# EAGLE design M700E (EAGLE 6.6.0)
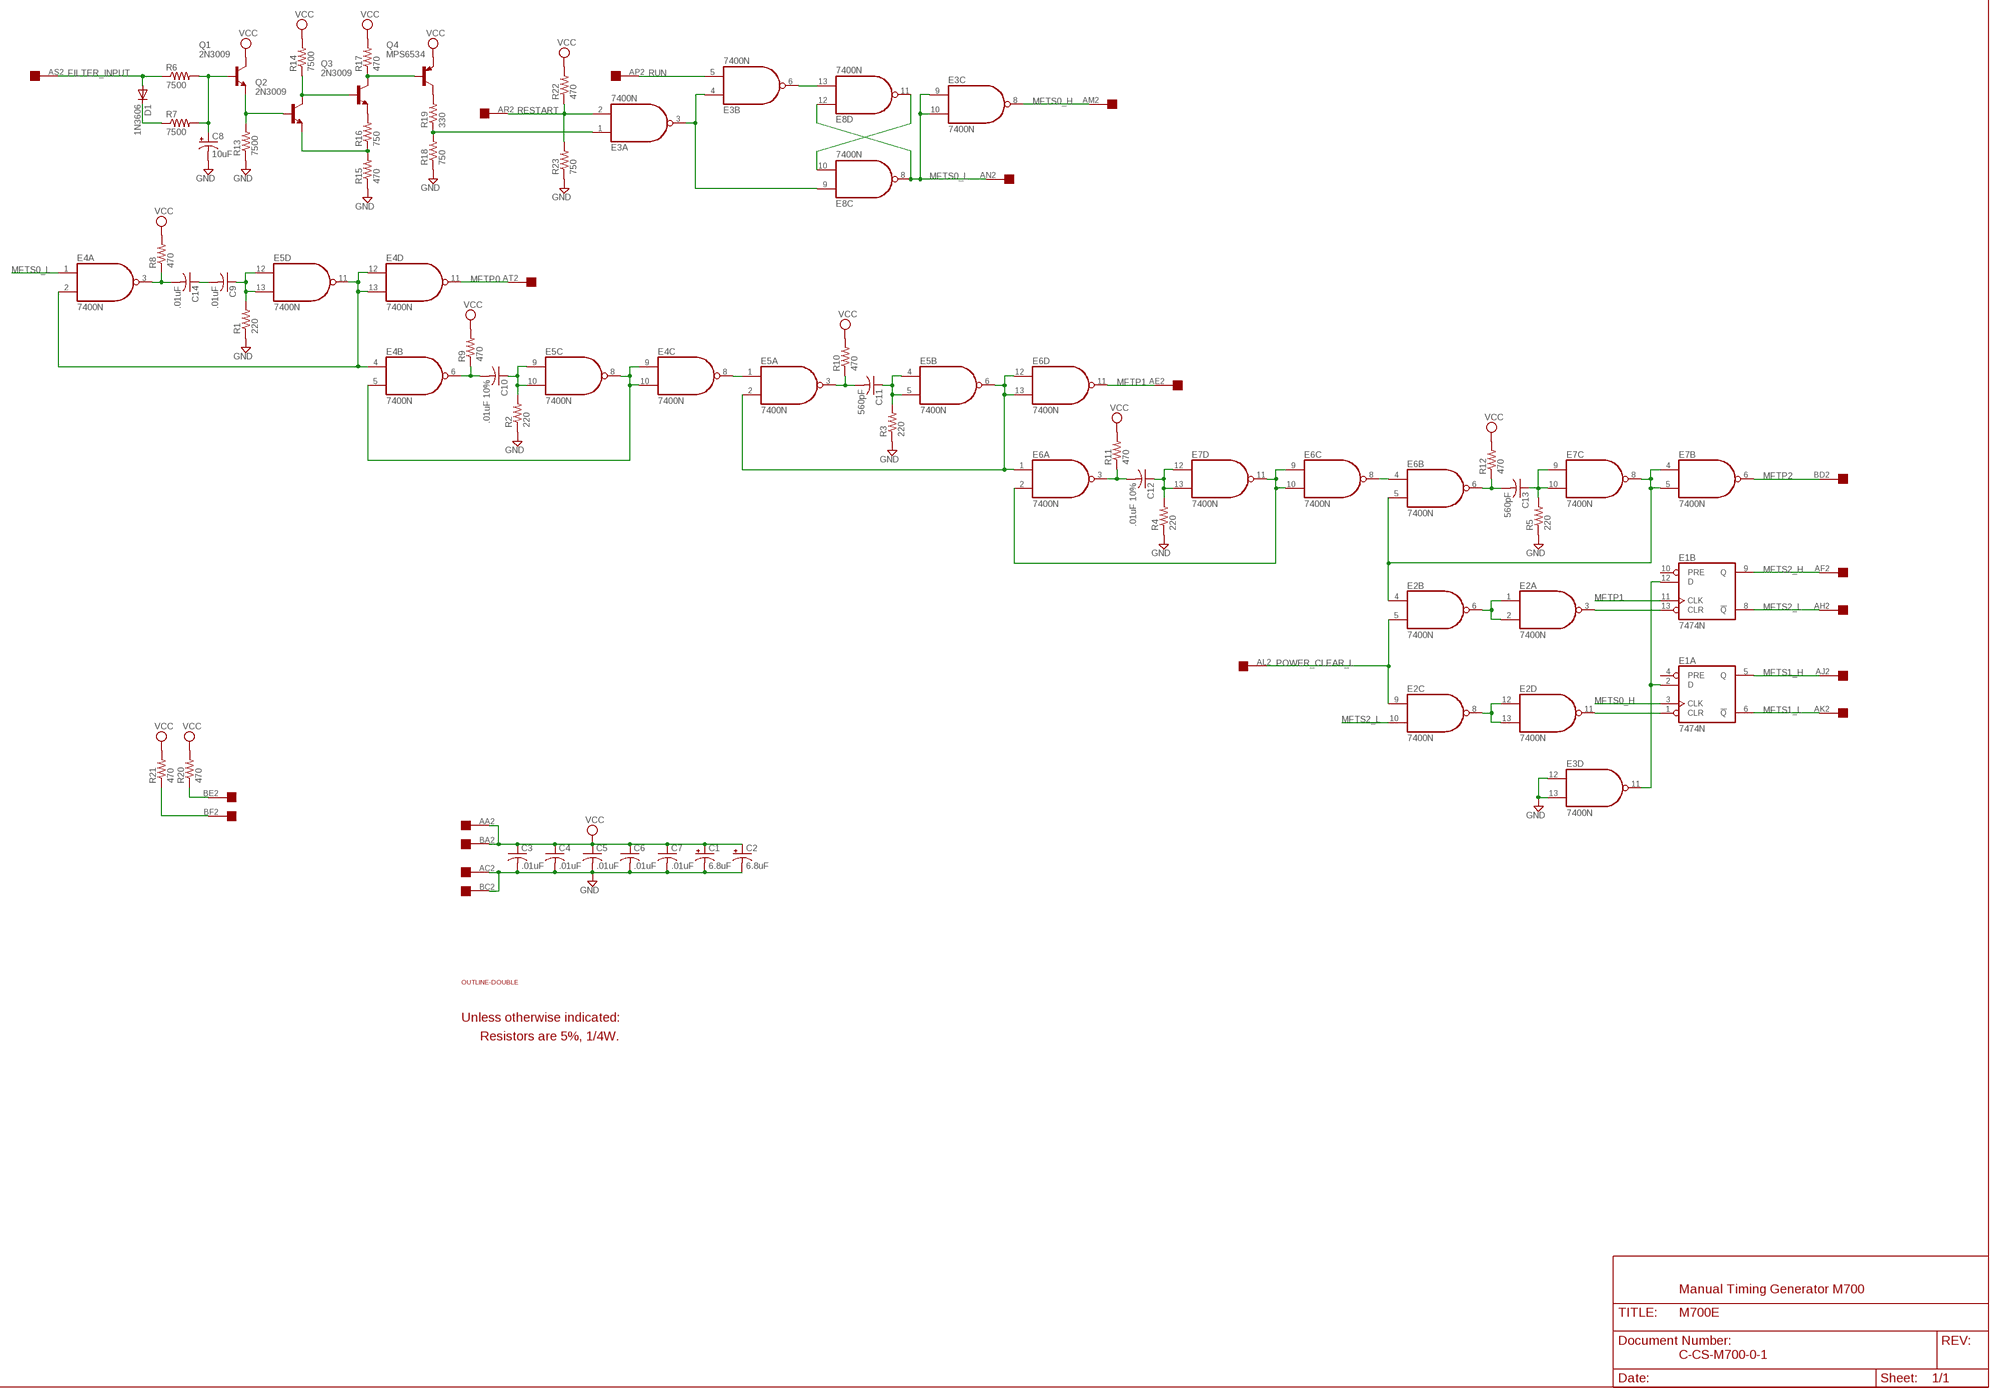
[diagram p0: schematic, sheet 1]

## Parts
C1  6.8uF  CPOL-USE20-8AXIAL  [E12-8]
C2  6.8uF  CPOL-USE20-8AXIAL  [E12-8]
C3  .01uF  C-US050-025X075  [C050-025X075]
C4  .01uF  C-US050-025X075  [C050-025X075]
C5  .01uF  C-US050-025X075  [C050-025X075]
C6  .01uF  C-US050-025X075  [C050-025X075]
C7  .01uF  C-US050-025X075  [C050-025X075]
C8  10uF  CPOL-USE20-8AXIAL  [E12-8]
C9  .01uF  C-US150-054X183  [C150-054X183]
C10  .01uF 10%  C-US150-054X183  [C150-054X183]
C11  560pF  C-US050-025X075  [C050-025X075]
C12  .01uF 10%  C-US150-054X183  [C150-054X183]
C13  560pF  C-US050-025X075  [C050-025X075]
C14  .01uF  C-US150-054X183  [C150-054X183]
D1  1N3606  1N4148DO35-10  [DO35-10]
E1  7474N  74S74N  [DIL14]
E2  7400N  [DIL14]
E3  7400N  [DIL14]
E4  7400N  [DIL14]
E5  7400N  [DIL14]
E6  7400N  [DIL14]
E7  7400N  [DIL14]
E8  7400N  [DIL14]
Q1  2N3009  2N2102  [TO5]
Q2  2N3009  2N2102  [TO5]
Q3  2N3009  2N2102  [TO5]
Q4  MPS6534  2N2905  [TO5]
R1  220  R-US_0207/10  [0207/10]
R2  220  R-US_0207/10  [0207/10]
R3  220  R-US_0207/10  [0207/10]
R4  220  R-US_0207/10  [0207/10]
R5  220  R-US_0207/10  [0207/10]
R6  7500  R-US_0207/10  [0207/10]
R7  7500  R-US_0207/10  [0207/10]
R8  470  R-US_0207/10  [0207/10]
R9  470  R-US_0207/10  [0207/10]
R10  470  R-US_0207/10  [0207/10]
R11  470  R-US_0207/10  [0207/10]
R12  470  R-US_0207/10  [0207/10]
R13  7500  R-US_0207/10  [0207/10]
R14  7500  R-US_0207/10  [0207/10]
R15  470  R-US_0207/10  [0207/10]
R16  750  R-US_0207/10  [0207/10]
R17  470  R-US_0207/10  [0207/10]
R18  750  R-US_0207/10  [0207/10]
R19  330  R-US_0207/10  [0207/10]
R20  470  R-US_0207/10  [0207/10]
R21  470  R-US_0207/10  [0207/10]
R22  470  R-US_0207/10  [0207/10]
R23  750  R-US_0207/10  [0207/10]
U$1  DOUBLE  [EDGE-CON4]
U$2  OUTLINE-DOUBLE  [DOUBLE]

## Nets
FILTER_INPUT: D1.A R6.1 U$1.AS2
GND [Supply]: C1.- C2.- C3.2 C4.2 C5.2 C6.2 C7.2 C8.- E3.12(D:I0) E3.13(D:I1) R1.1 R2.1 R3.1 R4.1 R5.1 R13.1 R15.1 R18.1 R23.1 U$1.AC2 U$1.BC2
MFTP0: E4.11(D:O) U$1.AT2
MFTP1: E1.11(B:CLK) E6.11(D:O) U$1.AE2
MFTP2: E7.6(B:O) U$1.BD2
MFTS0_H: E1.3(A:CLK) E3.8(C:O) U$1.AM2
MFTS0_L: E3.9(C:I0) E3.10(C:I1) E4.1(A:I0) E8.8(C:O) E8.12(D:I0) U$1.AN2
MFTS1_H: E1.5(A:Q) U$1.AJ2
MFTS1_L: E1.6(A:!Q) U$1.AK2
MFTS2_H: E1.9(B:Q) U$1.AF2
MFTS2_L: E1.8(B:!Q) E2.10(C:I1) U$1.AH2
N$1: E1.13(B:CLR) E2.3(A:O)
N$2: E2.4(B:I0) E6.5(B:I1) E7.4(B:I0) E7.5(B:I1) E7.8(C:O)
N$3: C13.1 E7.9(C:I0) E7.10(C:I1) R5.2
N$4: C13.2 E6.6(B:O) R12.1
N$5: E2.1(A:I0) E2.2(A:I1) E2.6(B:O)
N$6: C8.+ Q1.2(B) R6.2 R7.2
N$7: E1.2(A:D) E1.12(B:D) E3.11(D:O)
N$8: D1.C R7.1
N$9: Q2.3(C) Q3.2(B) R14.1
N$10: Q1.1(E) Q2.2(B) R13.2
N$11: R21.1 U$1.BF2
N$12: R20.1 U$1.BE2
N$13: Q3.3(C) Q4.2(B) R17.1
N$14: Q3.1(E) R16.2
N$15: Q2.1(E) R15.2 R16.1
N$16: Q4.3(C) R19.2
N$17: E3.1(A:I0) R18.2 R19.1
N$18: E3.3(A:O) E3.4(B:I0) E8.9(C:I0)
N$19: E8.10(C:I1) E8.11(D:O)
N$20: C9.1 E5.12(D:I0) E5.13(D:I1) R1.2
N$21: E3.6(B:O) E8.13(D:I1)
N$22: C14.2 E4.3(A:O) R8.1
N$23: C9.2 C14.1
N$24: E4.2(A:I1) E4.4(B:I0) E4.12(D:I0) E4.13(D:I1) E5.11(D:O)
N$25: C10.2 E4.6(B:O) R9.1
N$26: C10.1 E5.9(C:I0) E5.10(C:I1) R2.2
N$27: E4.5(B:I1) E4.9(C:I0) E4.10(C:I1) E5.8(C:O)
N$28: C11.2 E5.3(A:O) R10.1
N$29: E4.8(C:O) E5.1(A:I0)
N$30: C11.1 E5.4(B:I0) E5.5(B:I1) R3.2
N$31: E5.2(A:I1) E5.6(B:O) E6.1(A:I0) E6.12(D:I0) E6.13(D:I1)
N$32: C12.2 E6.3(A:O) R11.1
N$33: C12.1 E7.12(D:I0) E7.13(D:I1) R4.2
N$34: E6.2(A:I1) E6.9(C:I0) E6.10(C:I1) E7.11(D:O)
N$35: E2.8(C:O) E2.12(D:I0) E2.13(D:I1)
N$36: E6.4(B:I0) E6.8(C:O)
N$38: E1.1(A:CLR) E2.11(D:O)
POWER_CLEAR_L: E2.5(B:I1) E2.9(C:I0) U$1.AL2
RESTART: E3.2(A:I1) R22.1 R23.2 U$1.AR2
RUN: E3.5(B:I1) U$1.AP2
VCC [Supply]: C1.+ C2.+ C3.1 C4.1 C5.1 C6.1 C7.1 Q1.3(C) Q4.1(E) R8.2 R9.2 R10.2 R11.2 R12.2 R14.2 R17.2 R20.2 R21.2 R22.2 U$1.AA2 U$1.BA2
Unconnected: E1.4(A:PRE) E1.10(B:PRE) E7.1(A:I0) E7.2(A:I1) E7.3(A:O) E8.1(A:I0) E8.2(A:I1) E8.3(A:O) E8.4(B:I0) E8.5(B:I1) E8.6(B:O) U$1.AA1 U$1.AB1 U$1.AB2 U$1.AC1 U$1.AD1 U$1.AD2 U$1.AE1 U$1.AF1 U$1.AH1 U$1.AJ1 U$1.AK1 U$1.AL1 U$1.AM1 U$1.AN1 U$1.AP1 U$1.AR1 U$1.AS1 U$1.AT1 U$1.AU1 U$1.AU2 U$1.AV1 U$1.AV2 U$1.BA1 U$1.BB1 U$1.BB2 U$1.BC1 U$1.BD1 U$1.BE1 U$1.BF1 U$1.BH1 U$1.BH2 U$1.BJ1 U$1.BJ2 U$1.BK1 U$1.BK2 U$1.BL1 U$1.BL2 U$1.BM1 U$1.BM2 U$1.BN1 U$1.BN2 U$1.BP1 U$1.BP2 U$1.BR1 U$1.BR2 U$1.BS1 U$1.BS2 U$1.BT1 U$1.BT2 U$1.BU1 U$1.BU2 U$1.BV1 U$1.BV2

## Notes on the sheet
- Unless otherwise indicated:
- Resistors are 5%, 1/4W.
- Manual Timing Generator M700
- C-CS-M700-0-1

## Power pins joined to a net without a drawn wire
GND: E1.7(P:GND) E2.7(P:GND) E3.7(P:GND) E4.7(P:GND) E5.7(P:GND) E6.7(P:GND) E7.7(P:GND) E8.7(P:GND)
VCC: E1.14(P:VCC) E2.14(P:VCC) E3.14(P:VCC) E4.14(P:VCC) E5.14(P:VCC) E6.14(P:VCC) E7.14(P:VCC) E8.14(P:VCC)

## Library data of the parts
C1 C2 C8 = dec-con:CPOL-USE20-8AXIAL: A 0.8 inch electrolytic.
C3-C7 C9-C14 = rcl:C-US: CAPACITOR, American symbol
D1 = diode:1N4148: DIODE high speed (Philips)
E1 = 74xx-us:74*74: Dual D type positive edge triggered FLIP FLOP, preset and clear
E2-E8 = 74xx-us:74*00: Quad 2-input NAND gate
Q1-Q3 = transistor-npn:2N2102: NPN Transistor
Q4 = transistor-pnp:2N2905: PNP Transistor
R1-R23 = rcl:R-US_: RESISTOR, American symbol
U$1 = dec-con:DOUBLE: Double-Height DEC board
U$2 = dec-con:OUTLINE-*: Board outlines for DEC boards.

## Net classes
1 Supply: width 0.813 mm

## Board
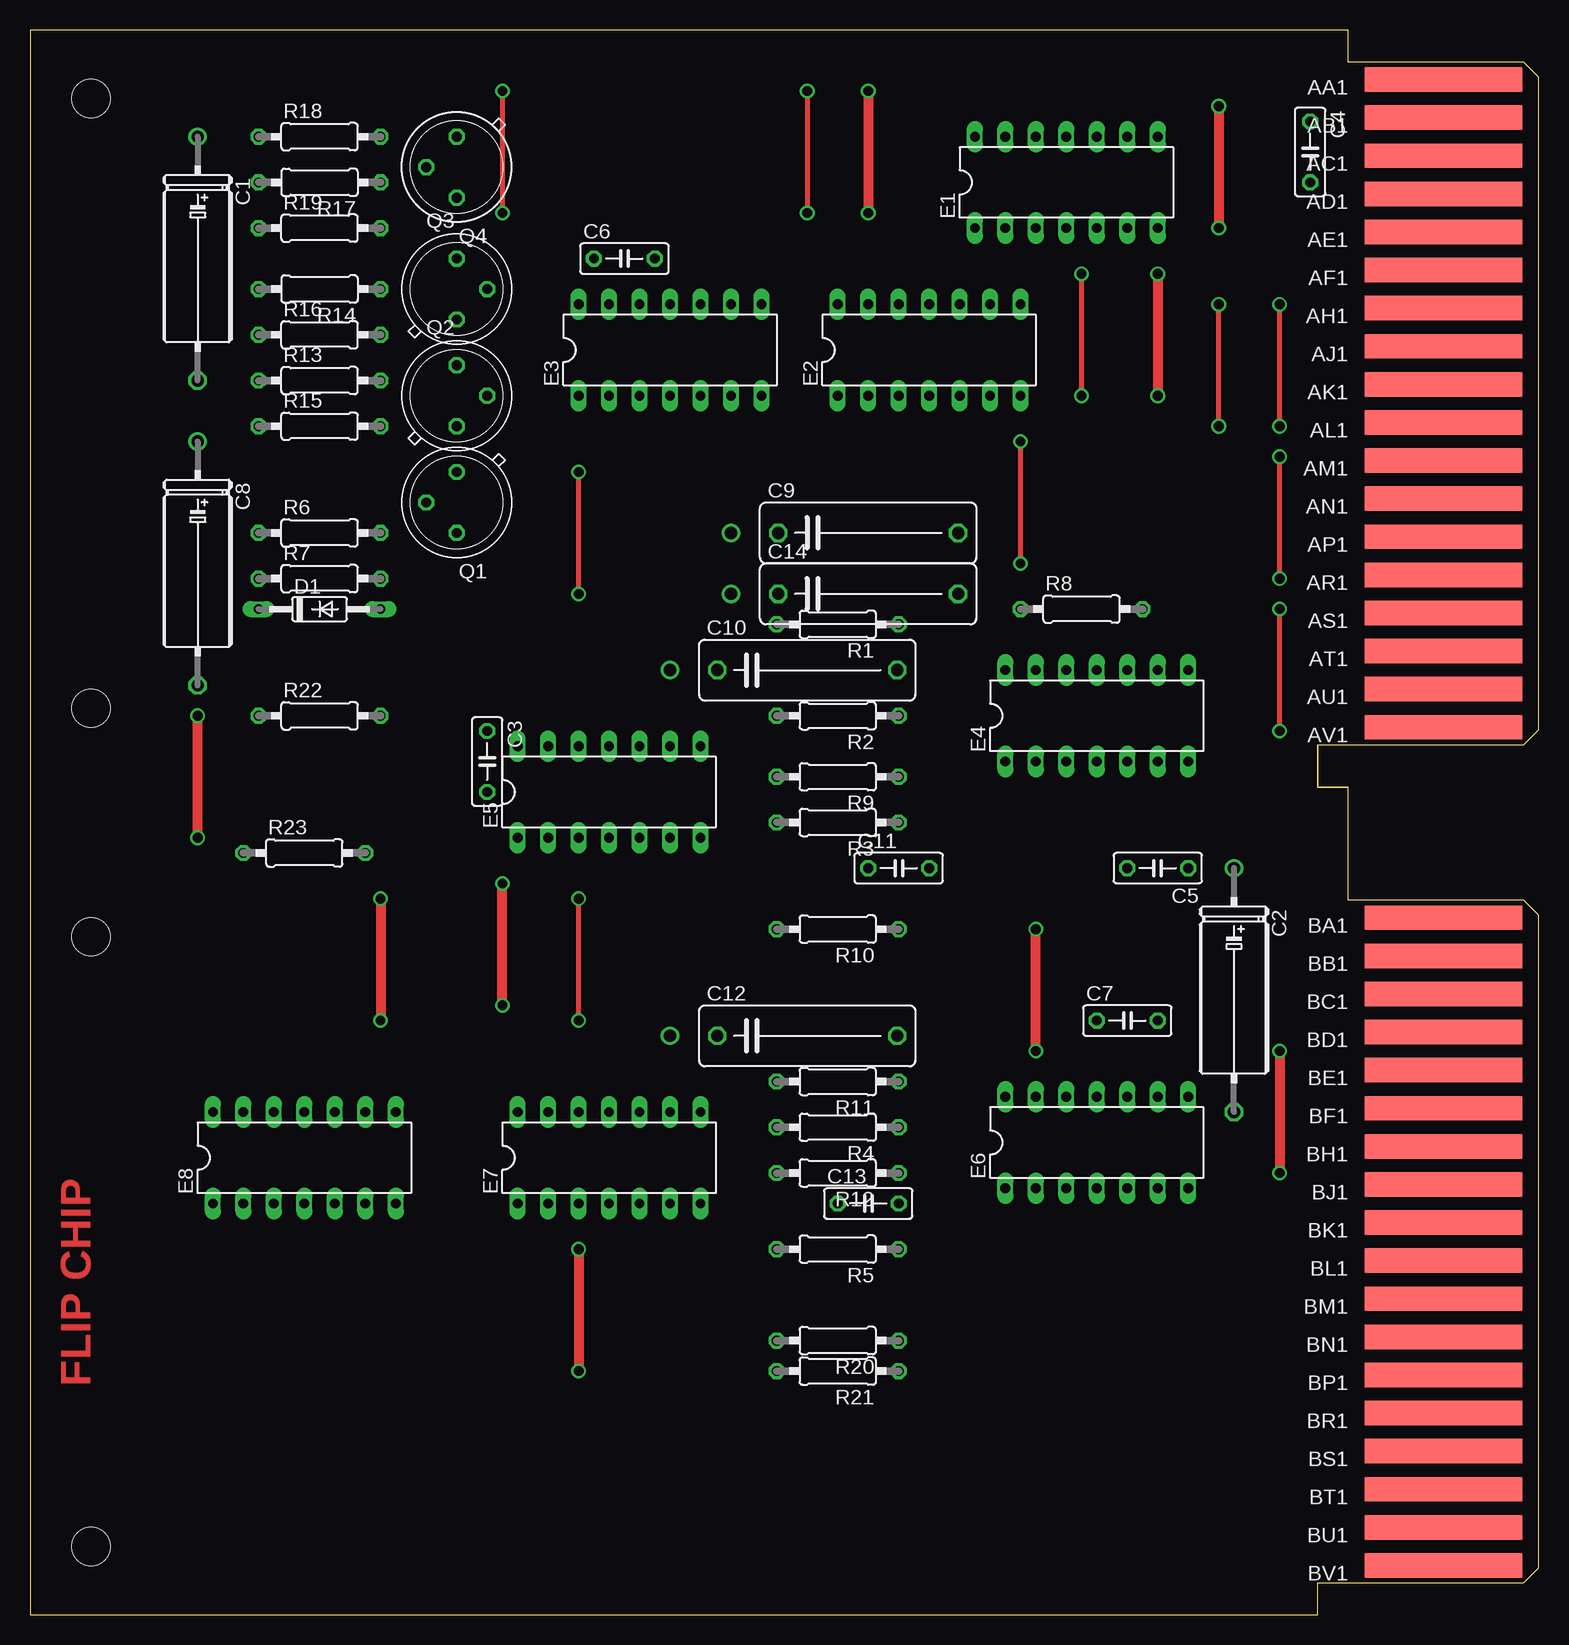
[diagram p1: board, top side]
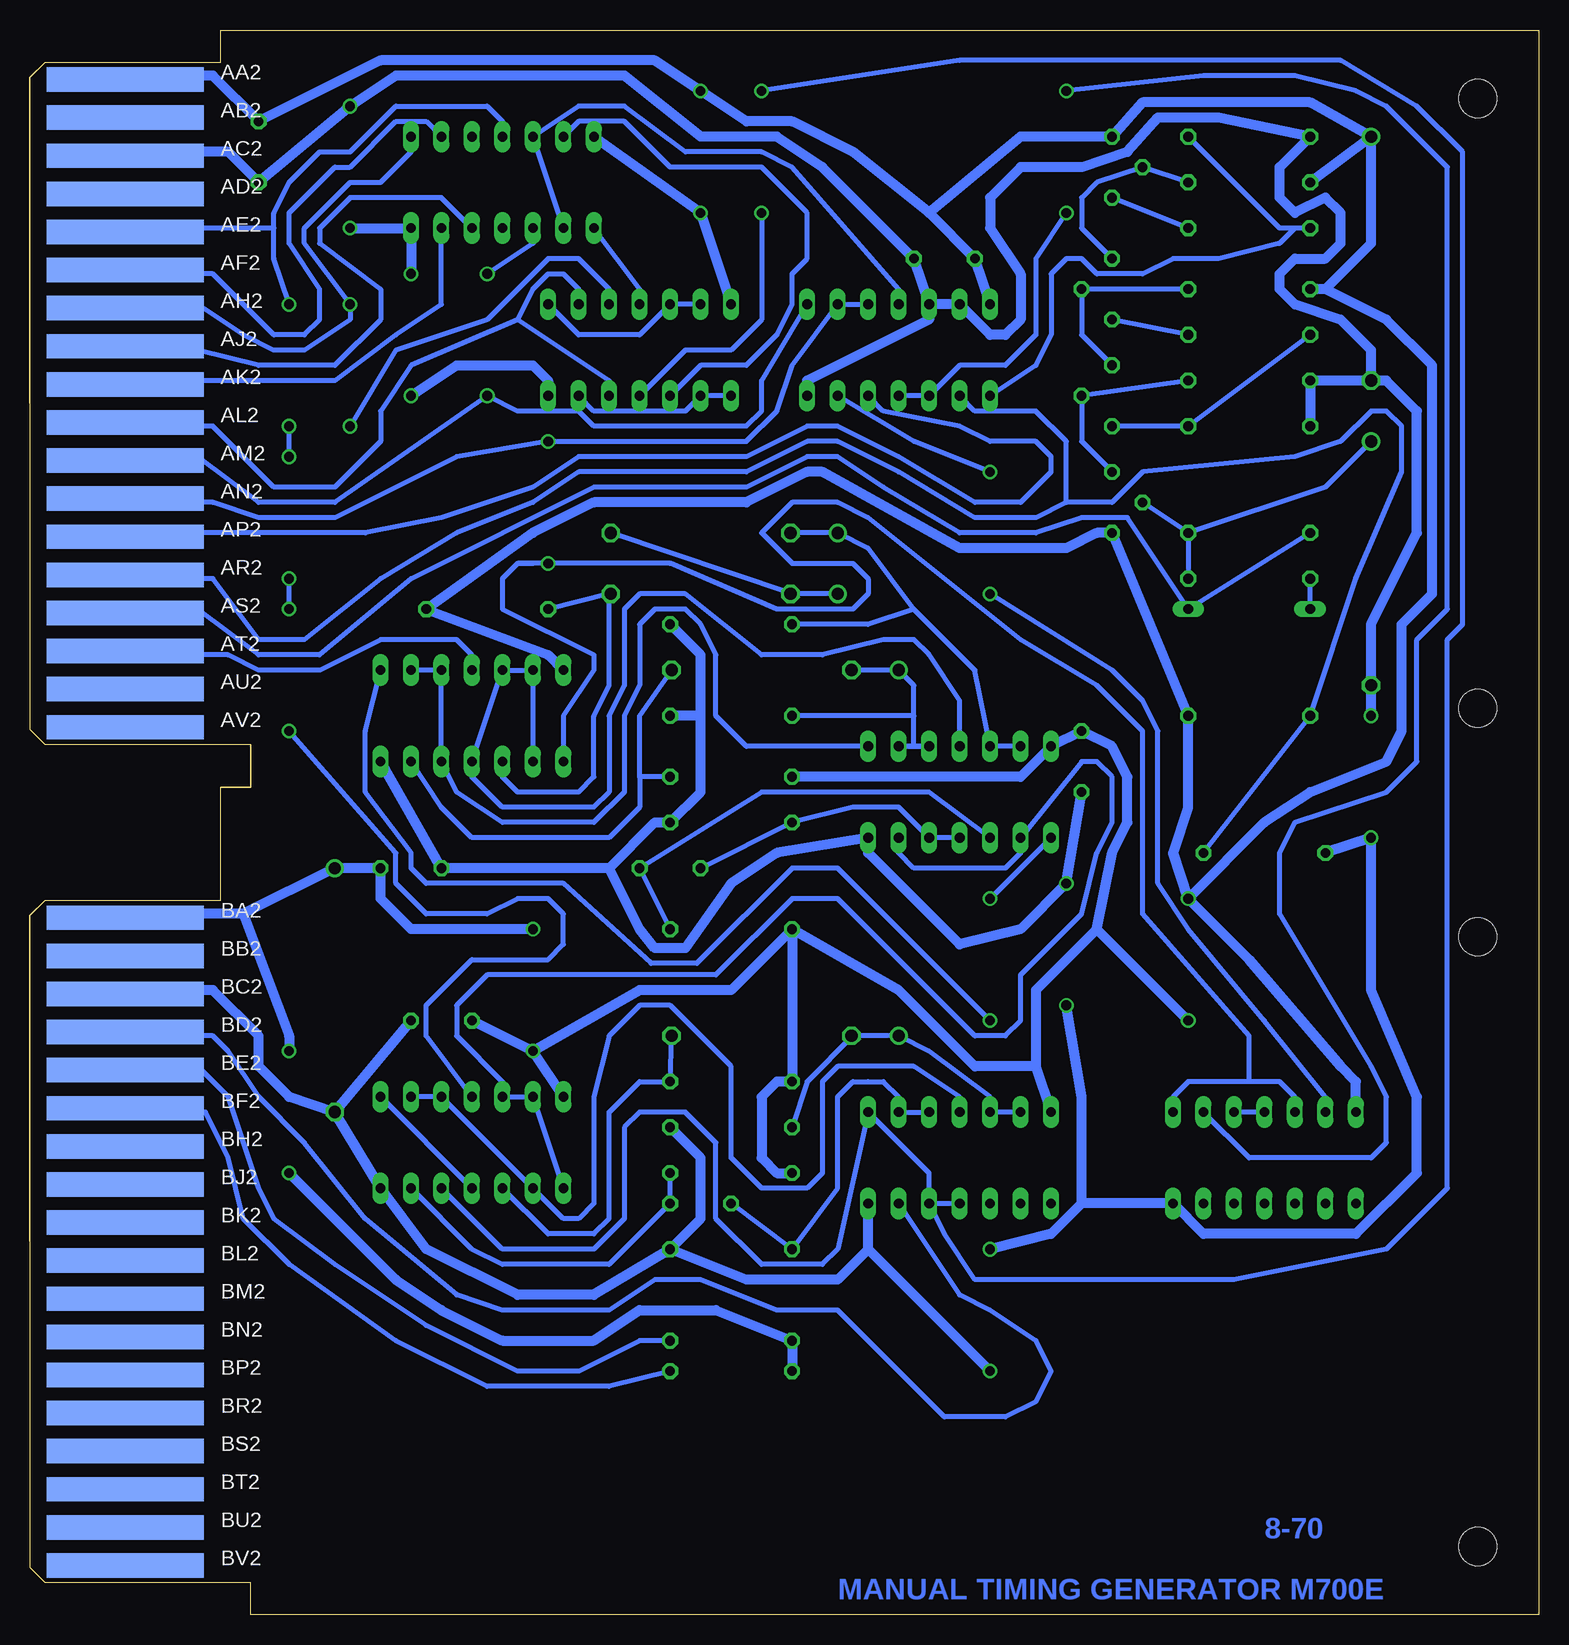
[diagram p2: board, bottom side, seen from below]

Size 125.73 x 132.08 mm. Coordinates in mm from the lower left corner, seen from the top.
Copper layers (1+16): Top 0.035mm / dielectric 1.5mm / Bottom 0.035mm
Design rules "16mils": minimum track width 16mil, minimum drill 32mil, track to track 15mil, track to pad 10mil, pad to pad 10mil, via to via 10mil, smd to smd 10mil, copper to edge 13mil, drill to drill 10mil, minimum pad ring 10mil, minimum via ring 8mil, stop-mask expansion 0mil, vias tented up to drill 0mil, thermal gap 10mil

### Footprints (pad centres in the part's own frame; a part is rotated, then mirrored left to right if it is on the bottom)
E12-8 = drill 1.016: + -10.16,0 | drill 1.016 octagon: - 10.16,0
C050-025X075 = drill 0.813 octagon: 1 -2.54,0; 2 2.54,0
C150-054X183 = drill 1.016 octagon: 1 -7.493,0; 2 7.493,0
DO35-10 = drill 0.813 long: A 5.08,0; C -5.08,0
DIL14 = drill 0.813 long: 1 -7.62,-3.81; 2 -5.08,-3.81; 3 -2.54,-3.81; 4 0,-3.81; 5 2.54,-3.81; 6 5.08,-3.81; 7 7.62,-3.81; 8 7.62,3.81; 9 5.08,3.81; 10 2.54,3.81; 11 0,3.81; 12 -2.54,3.81; 13 -5.08,3.81; 14 -7.62,3.81
TO5 = drill 0.813 octagon: 1 0,-2.54; 2 2.54,0; 3 0,2.54
0207/10 = drill 0.813 octagon: 1 -5.08,0; 2 5.08,0
EDGE-CON4 = smd 13.106 x 2.032: AA1 7.938,4.128; AB1 7.938,7.303; AC1 7.938,10.477; AD1 7.938,13.652; AE1 7.938,16.828; AF1 7.938,20.003; AH1 7.938,23.177; AJ1 7.938,26.352; AK1 7.938,29.527; AL1 7.938,32.703; AM1 7.938,35.877; AN1 7.938,39.053; AP1 7.938,42.227; AR1 7.938,45.403; AS1 7.938,48.578; AT1 7.938,51.752; AU1 7.938,54.928; AV1 7.938,58.102; BA1 7.938,73.978; BB1 7.938,77.153; BC1 7.938,80.328; BD1 7.938,83.502; BE1 7.938,86.677; BF1 7.938,89.853; BH1 7.938,93.028; BJ1 7.938,96.203; BK1 7.938,99.377; BL1 7.938,102.552; BM1 7.938,105.728; BN1 7.938,108.903; BP1 7.938,112.078; BR1 7.938,115.252; BS1 7.938,118.427; BT1 7.938,121.603; BU1 7.938,124.778; BV1 7.938,127.953 | smd 13.106 x 2.032 bottom: AA2 7.938,4.128; AB2 7.938,7.303; AC2 7.938,10.477; AD2 7.938,13.652; AE2 7.938,16.828; AF2 7.938,20.003; AH2 7.938,23.177; AJ2 7.938,26.352; AK2 7.938,29.527; AL2 7.938,32.703; AM2 7.938,35.877; AN2 7.938,39.053; AP2 7.938,42.227; AR2 7.938,45.403; AS2 7.938,48.578; AT2 7.938,51.752; AU2 7.938,54.928; AV2 7.938,58.102; BA2 7.938,73.978; BB2 7.938,77.153; BC2 7.938,80.328; BD2 7.938,83.502; BE2 7.938,86.677; BF2 7.938,89.853; BH2 7.938,93.028; BJ2 7.938,96.203; BK2 7.938,99.377; BL2 7.938,102.552; BM2 7.938,105.728; BN2 7.938,108.903; BP2 7.938,112.078; BR2 7.938,115.252; BS2 7.938,118.427; BT2 7.938,121.603; BU2 7.938,124.778; BV2 7.938,127.953
DOUBLE = hole 3.175: 120.65,56.515; 120.65,5.715; 120.65,75.565; 120.65,126.365

### Placement (x,y rotation side)
C1  13.97,113.03 270 top
C2  100.33,52.07 270 top
C3  38.1,71.12 270 top
C4  106.68,121.92 270 top
C5  93.98,62.23 180 top
C6  49.53,113.03 0 top
C7  91.44,49.53 0 top
C8  13.97,87.63 270 top
C9  69.85,90.17 0 top
C10  64.77,78.74 0 top
C11  72.39,62.23 0 top
C12  64.77,48.26 0 top
C13  69.85,34.29 0 top
C14  69.85,85.09 0 top
D1  24.13,83.82 0 top
E1  86.36,119.38 0 top
E2  74.93,105.41 0 top
E3  53.34,105.41 0 top
E4  88.9,74.93 0 top
E5  48.26,68.58 0 top
E6  88.9,39.37 0 top
E7  48.26,38.1 0 top
E8  22.86,38.1 0 top
Q1  35.56,92.71 180 top
Q2  35.56,101.6 0 top
Q3  35.56,110.49 0 top
Q4  35.56,120.65 180 top
R1  67.31,82.55 180 top
R2  67.31,74.93 180 top
R3  67.31,66.04 180 top
R4  67.31,40.64 180 top
R5  67.31,30.48 180 top
R6  24.13,90.17 0 top
R7  24.13,86.36 0 top
R8  87.63,83.82 0 top
R9  67.31,69.85 180 top
R10  67.31,57.15 180 top
R11  67.31,44.45 180 top
R12  67.31,36.83 180 top
R13  24.13,102.87 0 top
R14  24.13,110.49 180 top
R15  24.13,99.06 0 top
R16  24.13,106.68 0 top
R17  24.13,119.38 180 top
R18  24.13,123.19 0 top
R19  24.13,115.57 0 top
R20  67.31,22.86 180 top
R21  67.31,20.32 180 top
R22  24.13,74.93 0 top
R23  22.86,63.5 0 top
U$1  125.73,132.08 180 top
U$2  125.73,132.08 180 top
U$4  [FLIPCHIP]  0,0 0 top

### Tracks (layer width: path | path; a pad name or v marks a point on that pad's centre or on a via)
FILTER_INPUT
  Bottom 0.406: R6.1 D1.A 34.29,91.44 38.1,91.44 41.91,90.17 48.26,90.17 54.61,93.98 58.42,96.52 60.96,96.52 66.04,93.98 78.74,93.98 93.98,86.36 101.6,80.01 106.68,80.01 111.76,83.82 116.84,83.82 U$1.AS2
GND  (via drill 0.81)
  Top 0.813: v13.97,64.77 v13.97,74.93 | v99.06,125.73 v99.06,115.57 | v93.98,111.76 v93.98,101.6 | v45.72,30.48 v45.72,20.32 | v39.37,50.8 v39.37,60.96
  Bottom 0.813: v13.97,74.93 C8.- 13.97,82.55 10.16,90.17 10.16,100.33 12.7,102.87 C1.- | R23.1 v13.97,64.77 13.97,52.07 10.16,43.18 10.16,36.83 15.24,31.75 27.94,31.75 E8.7 38.1,34.29 | U$1.AC2 116.84,121.92 109.22,121.92 C4.2 v99.06,125.73 95.25,128.27 76.2,128.27 69.85,123.19 63.5,123.19 59.69,120.65 C6.2 E3.12 | v99.06,115.57 E1.7 v93.98,111.76 | E3.12 E3.13 45.72,106.68 44.45,106.68 43.18,107.95 43.18,111.76 45.72,115.57 45.72,118.11 43.18,120.65 38.1,120.65 34.29,121.92 31.75,124.78 26.67,124.78 R18.1 21.59,120.65 21.59,118.11 20.32,116.84 17.78,118.11 16.51,116.84 16.51,114.3 17.78,113.03 20.32,113.03 21.59,111.76 21.59,110.49 20.32,109.22 16.51,107.95 13.97,105.41 C1.- | 55.88,30.48 E7.7 | 55.88,30.48 58.42,27.94 66.04,27.94 R5.1 | R5.1 78.74,26.67 85.09,26.67 92.71,30.48 E6.7 C2.- | C2.- C7.2 | U$1.BC2 116.84,52.07 110.49,52.07 106.68,48.26 106.68,45.72 104.14,43.18 C2.- | E3.7 60.96,102.87 50.8,107.95 E3.12 | E2.7 82.55,102.87 83.82,104.14 90.17,104.14 v93.98,101.6 | E4.7 C5.2 77.47,62.23 | 77.47,62.23 73.66,66.04 R3.1 69.85,68.58 69.85,74.93 | 77.47,62.23 74.93,57.15 73.66,55.56 71.12,55.56 67.31,60.96 63.5,63.5 E5.7 55.88,63.5 48.26,55.88 43.18,57.15 v39.37,60.96 C3.2 | C1.- R13.1 R15.1 | v45.72,20.32 55.88,30.48 | v45.72,30.48 40.64,31.75 38.1,34.29 | 38.1,34.29 38.1,43.18 v39.37,50.8 | R4.1 69.85,38.1 69.85,33.02 R5.1 | 69.85,74.93 R2.1 | 69.85,74.93 69.85,80.01 R1.1
MFTP0
  Bottom 0.406: U$1.AT2 116.84,80.01 109.22,80.01 106.68,78.74 101.6,78.74 96.52,81.28 90.17,81.28 88.9,80.01 E4.11
MFTP1  (via drill 0.81)
  Top 0.406: v104.14,99.06 v104.14,109.22 | v104.14,86.36 v104.14,96.52 | v104.14,73.66 v104.14,83.82
  Bottom 0.406: E1.11 86.36,124.46 87.63,125.73 95.25,125.73 99.06,121.92 101.6,121.92 104.14,119.38 105.41,116.84 105.41,115.57 | 105.41,115.57 105.41,113.03 v104.14,109.22 | U$1.AE2 116.84,115.57 105.41,115.57 | v104.14,96.52 v104.14,99.06 | v104.14,83.82 v104.14,86.36 | v104.14,73.66 95.25,63.5 95.25,60.96 92.71,58.42 87.63,58.42 85.09,59.69 82.55,59.69 81.28,58.42 81.28,55.88 82.55,54.61 88.9,54.61 92.71,50.8 92.71,48.26 E6.11
MFTP2
  Bottom 0.406: E7.6 48.26,26.67 45.72,25.4 41.91,22.86 40.64,20.32 41.91,17.78 44.45,16.51 49.53,16.51 58.42,25.4 63.5,25.4 69.85,27.94 73.66,27.94 77.47,25.4 86.36,25.4 90.17,26.67 97.79,33.02 102.87,39.37 106.68,43.18 109.22,46.99 110.49,48.26 115.57,48.26 U$1.BD2
MFTS0_H  (via drill 0.81)
  Top 0.406: v87.63,101.6 v87.63,111.76
  Bottom 0.406: E1.3 83.82,114.3 v87.63,111.76 | E3.8 64.77,102.87 64.77,100.33 66.04,99.06 78.74,99.06 80.01,100.33 85.09,100.33 v87.63,101.6 100.33,92.71 106.68,92.71 111.76,96.52 116.84,96.52 U$1.AM2
MFTS0_L  (via drill 0.81)
  Top 0.406: v82.55,87.63 v82.55,97.79
  Bottom 0.406: E3.10 E3.9 62.23,104.14 63.5,100.33 66.04,97.79 v82.55,97.79 90.17,96.52 100.33,91.44 106.68,91.44 110.49,92.71 116.84,92.71 U$1.AN2 | E8.12 20.32,43.18 21.59,44.45 24.13,44.45 | 24.13,44.45 29.21,44.45 30.48,43.18 E8.8 | 24.13,44.45 24.13,48.26 33.02,58.42 33.02,73.66 36.83,77.47 43.18,81.28 55.88,91.44 58.42,92.71 62.23,92.71 64.77,90.17 62.23,87.63 57.15,87.63 55.88,86.36 55.88,85.09 57.15,83.82 63.5,83.82 72.39,87.63 v82.55,87.63 85.09,87.63 | E4.1 81.28,74.93 78.74,78.74 78.74,80.01 86.36,83.82 86.36,86.36 85.09,87.63 | 85.09,87.63 83.82,87.63
MFTS1_H
  Bottom 0.406: E1.5 91.44,118.11 99.06,118.11 101.6,115.57 101.6,114.3 96.52,110.49 96.52,107.95 100.33,104.14 106.68,104.14 111.76,105.41 116.84,105.41 U$1.AJ2
MFTS1_L
  Bottom 0.406: E1.6 91.44,109.22 95.25,106.68 100.33,102.87 115.57,102.87 U$1.AK2
MFTS2_H
  Bottom 0.406: E1.9 92.71,124.46 95.25,124.46 99.06,120.65 100.33,120.65 104.14,116.84 104.14,114.3 101.6,110.49 101.6,107.95 102.87,106.68 105.41,106.68 110.49,111.76 116.84,111.76 U$1.AF2
MFTS2_L  (via drill 0.81)
  Top 0.406: v99.06,99.06 v99.06,109.22
  Bottom 0.406: E1.8 93.98,121.92 96.52,119.38 99.06,119.38 102.87,115.57 102.87,114.3 v99.06,109.22 99.06,107.95 102.87,105.41 105.41,105.41 107.95,106.68 111.76,109.22 116.84,109.22 U$1.AH2 | E2.10 77.47,110.49 80.01,113.03 82.55,113.03 87.63,107.95 95.25,105.41 v99.06,99.06
N$1
  Bottom 0.406: E1.13 80.01,124.46 76.2,124.46 72.39,120.65 64.77,120.65 60.96,116.84 60.96,113.03 62.23,111.76 62.23,109.22 63.5,106.68 66.04,104.14 69.85,104.14 E2.3
N$2  (via drill 0.81)
  Top 0.406: v64.77,127 v64.77,116.84
  Bottom 0.406: E7.5 50.8,36.83 E7.8 58.42,30.48 59.69,29.21 64.77,29.21 68.58,33.02 68.58,39.37 71.12,41.91 74.93,41.91 76.2,40.64 76.2,33.02 78.74,30.48 86.36,30.48 E6.5 | E7.5 E7.4 | E7.5 49.53,31.75 46.99,27.94 25.4,27.94 12.7,30.48 7.62,35.56 7.62,81.28 6.35,82.55 6.35,121.92 10.16,125.73 16.51,129.54 48.26,129.54 v64.77,127 | E2.4 71.12,105.41 67.31,105.41 64.77,107.95 v64.77,116.84
N$3
  Bottom 0.406: E7.10 E7.9 53.34,43.18 54.61,44.45 55.88,44.45 57.15,44.45 58.42,43.18 58.42,41.91 58.42,35.56 R5.2 C13.1
N$4
  Bottom 0.406: E6.6 88.9,30.48 86.36,29.21 77.47,29.21 C13.2 R12.1
N$5
  Bottom 0.406: E2.6 78.74,100.33 71.12,100.33 E2.2 E2.1
N$6
  Bottom 0.406: C8.+ 17.78,93.98 R6.2 | R6.2 R7.2 | R6.2 Q1.2
N$7
  Bottom 0.406: E1.2 E1.12 80.01,125.73 76.2,125.73 71.12,121.92 64.77,121.92 62.23,120.65 53.34,110.49 E3.11
N$8
  Bottom 0.406: D1.C R7.1
N$9
  Bottom 0.406: R14.1 Q3.2 38.1,106.68 Q2.3
N$10
  Bottom 0.406: R13.2 Q2.2 38.1,97.79 Q1.1
N$11
  Bottom 0.406: R21.1 77.47,19.05 87.63,19.05 95.25,22.86 104.14,29.21 107.95,33.02 109.22,38.1 111.12,41.91 116.84,41.91 U$1.BF2
N$12
  Bottom 0.406: R20.1 74.93,22.86 80.01,20.32 85.09,20.32 92.71,24.13 100.33,29.21 105.41,33.02 106.68,35.56 109.22,43.18 111.76,45.72 116.84,45.72 U$1.BE2
N$13
  Bottom 0.406: R17.1 Q4.2 36.83,119.38 38.1,118.11 38.1,115.57 Q3.3
N$14
  Bottom 0.406: R16.2 Q3.1
N$15
  Bottom 0.406: R16.1 R15.2 Q2.1
N$16
  Bottom 0.406: R19.2 Q4.3
N$17
  Bottom 0.406: 20.32,115.57 21.59,115.57 R18.2 | E3.1 41.91,104.14 40.64,106.68 40.64,111.76 39.37,113.03 38.1,113.03 36.83,111.76 33.02,111.76 30.48,113.03 26.67,113.03 21.59,114.3 20.32,115.57 | R19.1 20.32,115.57
N$18  (via drill 0.81)
  Top 0.406: v39.37,127 v39.37,116.84
  Bottom 0.406: v39.37,116.84 41.91,113.03 41.91,106.68 44.45,104.14 48.26,104.14 E3.3 E3.4 | v39.37,127 27.94,128.27 20.32,128.27 15.24,127 12.7,125.73 7.62,120.65 7.62,83.82 10.16,81.28 10.16,71.12 12.7,68.58 20.32,66.04 21.59,63.5 21.59,58.42 13.97,45.72 12.7,43.18 12.7,39.37 13.97,38.1 24.13,38.1 E8.9
N$19
  Bottom 0.406: E8.11 E8.10
N$20  (via drill 1.02)
  Bottom 0.406: E5.13 E5.12 46.99,78.74 52.07,83.82 | 52.07,83.82 55.88,82.55 R1.2 | C9.1 v58.42,90.17 55.88,88.9 52.07,83.82
N$21  (via drill 0.81)
  Top 0.406: v45.72,85.09 v45.72,95.25
  Bottom 0.406: E8.13 17.78,43.18 22.86,49.53 29.21,57.15 31.75,60.96 31.75,73.66 33.02,76.2 35.56,78.74 v45.72,85.09 | v45.72,95.25 52.07,97.79 E3.6
N$22
  Bottom 0.406: 77.47,85.09 C14.2 | 77.47,85.09 77.47,77.47 78.74,74.93 78.74,69.85 80.01,68.58 85.09,68.58 86.36,69.85 E4.3 | 77.47,85.09 R8.1
N$23  (via drill 1.02)
  Bottom 0.406: v58.42,85.09 62.23,85.09 | 62.23,85.09 C14.1 | 62.23,85.09 C9.2
N$24
  Bottom 0.406: E4.2 E4.13 E4.12 E4.4 88.9,69.85 86.36,67.31 78.74,67.31 77.47,68.58 77.47,74.93 76.2,77.47 76.2,83.82 74.93,85.09 71.12,85.09 64.77,80.01 59.69,80.01 54.61,81.28 52.07,81.28 50.8,80.01 48.26,76.2 E5.11
N$25
  Bottom 0.406: E4.6 91.44,67.31 88.9,64.77 77.47,64.77 74.93,67.31 74.93,69.85 | 74.93,69.85 74.93,74.93 C10.2 | R9.1 74.93,69.85
N$26  (via drill 1.02)
  Bottom 0.406: E5.10 E5.9 E5.10 | 52.07,74.93 R2.2 | E5.10 52.07,72.39 52.07,74.93 | C10.1 v53.34,78.74 52.07,77.47 52.07,74.93
N$27
  Bottom 0.406: E4.9 E4.10 E4.5 90.17,68.58 86.36,66.04 78.74,66.04 76.2,68.58 76.2,74.93 74.93,77.47 74.93,82.55 73.66,83.82 71.12,83.82 69.85,82.55 68.58,80.01 68.58,74.93 66.04,72.39 E5.8
N$28
  Bottom 0.406: E5.3 50.8,68.58 64.77,68.58 C11.2 R10.1
N$29  (via drill 0.81)
  Top 0.406: v45.72,49.53 v45.72,59.69
  Bottom 0.406: v45.72,59.69 E5.1 | v45.72,49.53 58.42,62.23 62.23,62.23 70.17,54.29 73.98,54.29 81.28,60.96 92.71,60.96 93.98,62.23 93.98,63.5 97.79,68.58 97.79,73.66 E4.8
N$30
  Bottom 0.406: E5.4 E5.5 53.34,67.31 57.15,67.31 R3.2 C11.1
N$31
  Bottom 0.406: E6.1 E6.13 E6.12 86.36,44.45 90.17,48.26 90.17,50.8 87.63,53.34 68.58,53.34 62.23,59.69 58.42,59.69 46.99,48.26 44.45,48.26 43.18,49.53 43.18,53.34 38.1,58.42 36.83,63.5 35.56,66.04 35.56,69.85 36.83,71.12 38.1,71.12 E5.2 43.18,63.5 44.45,62.23 52.07,62.23 53.34,63.5 E5.6
N$32
  Bottom 0.406: R11.1 C12.2 R11.1 | E6.3 82.55,31.75 78.74,31.75 77.47,33.02 77.47,41.91 74.93,44.45 R11.1
N$33  (via drill 1.02)
  Bottom 0.406: E7.13 E7.12 45.72,43.18 50.8,46.99 v53.34,48.26 57.15,48.26 | 57.15,48.26 60.96,44.45 R4.2 | 57.15,48.26 C12.1
N$34
  Bottom 0.406: E6.9 E6.10 E6.2 81.28,33.02 80.01,33.02 78.74,34.29 78.74,43.18 77.47,48.26 74.93,50.8 72.39,50.8 67.31,45.72 67.31,38.1 64.77,35.56 60.96,35.56 59.69,36.83 59.69,44.45 58.42,45.72 52.07,45.72 48.26,43.18 E7.11
N$35
  Bottom 0.406: E2.8 80.01,106.68 74.93,106.68 E2.12 E2.13
N$36
  Bottom 0.406: E6.4 E6.8
N$38
  Bottom 0.406: E2.11 74.93,110.49 E1.1
POWER_CLEAR_L
  Bottom 0.406: E2.9 80.01,110.49 81.28,111.76 82.55,111.76 83.82,110.49 85.09,107.95 | 85.09,107.95 77.47,102.87 E2.5 | U$1.AL2 116.84,99.06 110.49,99.06 105.41,93.98 100.33,93.98 96.52,97.79 96.52,100.33 93.98,104.14 85.09,107.95
RESTART
  Bottom 0.406: R23.2 R22.1 15.24,86.36 11.43,95.25 11.43,99.06 12.7,100.33 13.97,100.33 16.51,97.79 20.32,96.52 33.02,95.25 35.56,92.71 39.37,92.71 | E3.2 46.99,100.33 41.91,100.33 39.37,97.79 39.37,92.71 | U$1.AR2 116.84,86.36 110.49,86.36 106.68,81.28 102.87,81.28 96.52,86.36 90.17,90.17 83.82,92.71 80.01,95.25 66.04,95.25 60.96,97.79 58.42,97.79 53.34,95.25 46.99,91.44 41.91,91.44 39.37,92.71
RUN
  Bottom 0.406: U$1.AP2 116.84,90.17 97.79,90.17 91.44,91.44 83.82,93.98 80.01,96.52 66.04,96.52 60.96,99.06 58.42,99.06 53.34,96.52 46.99,92.71 43.18,92.71 40.64,95.25 40.64,96.52 41.91,97.79 45.72,97.79 48.26,99.06 54.61,100.33 E3.5
VCC  (via drill 0.81)
  Top 0.813: v69.85,127 v69.85,116.84 | v104.14,46.99 v104.14,36.83 | v83.82,46.99 v83.82,57.15 | v29.21,59.69 v29.21,49.53
  Bottom 0.813: U$1.AA2 116.84,128.27 110.49,128.27 C4.1 96.52,129.54 73.66,129.54 v69.85,127 66.04,124.46 62.23,124.46 57.15,121.92 50.8,116.84 | E2.14 v69.85,116.84 E1.14 | E3.14 C6.1 50.8,116.84 | U$1.BA2 116.84,58.42 107.95,58.42 | 107.95,58.42 C2.+ C5.1 96.52,59.69 93.98,57.15 v83.82,57.15 | 107.95,58.42 104.14,48.26 v104.14,46.99 | v104.14,36.83 95.25,27.94 91.44,25.4 86.36,22.86 78.74,22.86 74.93,25.4 68.58,25.4 R20.2 R21.2 | R11.2 63.5,44.45 64.77,43.18 64.77,38.1 63.5,36.83 R12.2 | R10.2 R11.2 | 41.91,45.72 E7.14 | 41.91,45.72 46.99,45.72 53.34,52.07 R10.2 | R10.2 R11.2 | 36.83,57.15 35.56,63.5 34.29,66.04 34.29,69.85 35.56,72.39 C3.1 E5.14 43.18,69.85 R9.2 | 36.83,57.15 41.91,52.07 41.91,45.72 | E8.14 15.24,44.45 16.51,45.72 24.13,54.61 v29.21,59.69 | v29.21,59.69 22.86,66.04 19.05,68.58 12.7,71.12 11.43,73.66 11.43,82.55 8.89,85.09 8.89,104.14 12.7,107.95 17.78,110.49 | v29.21,59.69 30.48,63.5 29.21,67.31 R22.2 Q1.3 36.83,90.17 39.37,88.9 48.26,88.9 59.69,95.25 60.96,95.25 66.04,92.71 78.74,92.71 83.82,90.17 R8.2 82.55,80.01 E4.14 | C1.+ 19.05,126.05 33.02,126.05 Q4.1 43.18,123.19 50.8,116.84 | C1.+ R17.2 | 17.78,110.49 R14.2 | 17.78,110.49 13.97,114.3 C1.+ | v83.82,46.99 C7.1 | v83.82,46.99 E6.14 | R10.2 67.31,52.07 74.93,52.07 v83.82,46.99 | v29.21,49.53 36.83,57.15

### Text on the board
Bottom: 8-70 | MANUAL TIMING GENERATOR M700E